# EAGLE design L298card2007 (EAGLE 4.16)
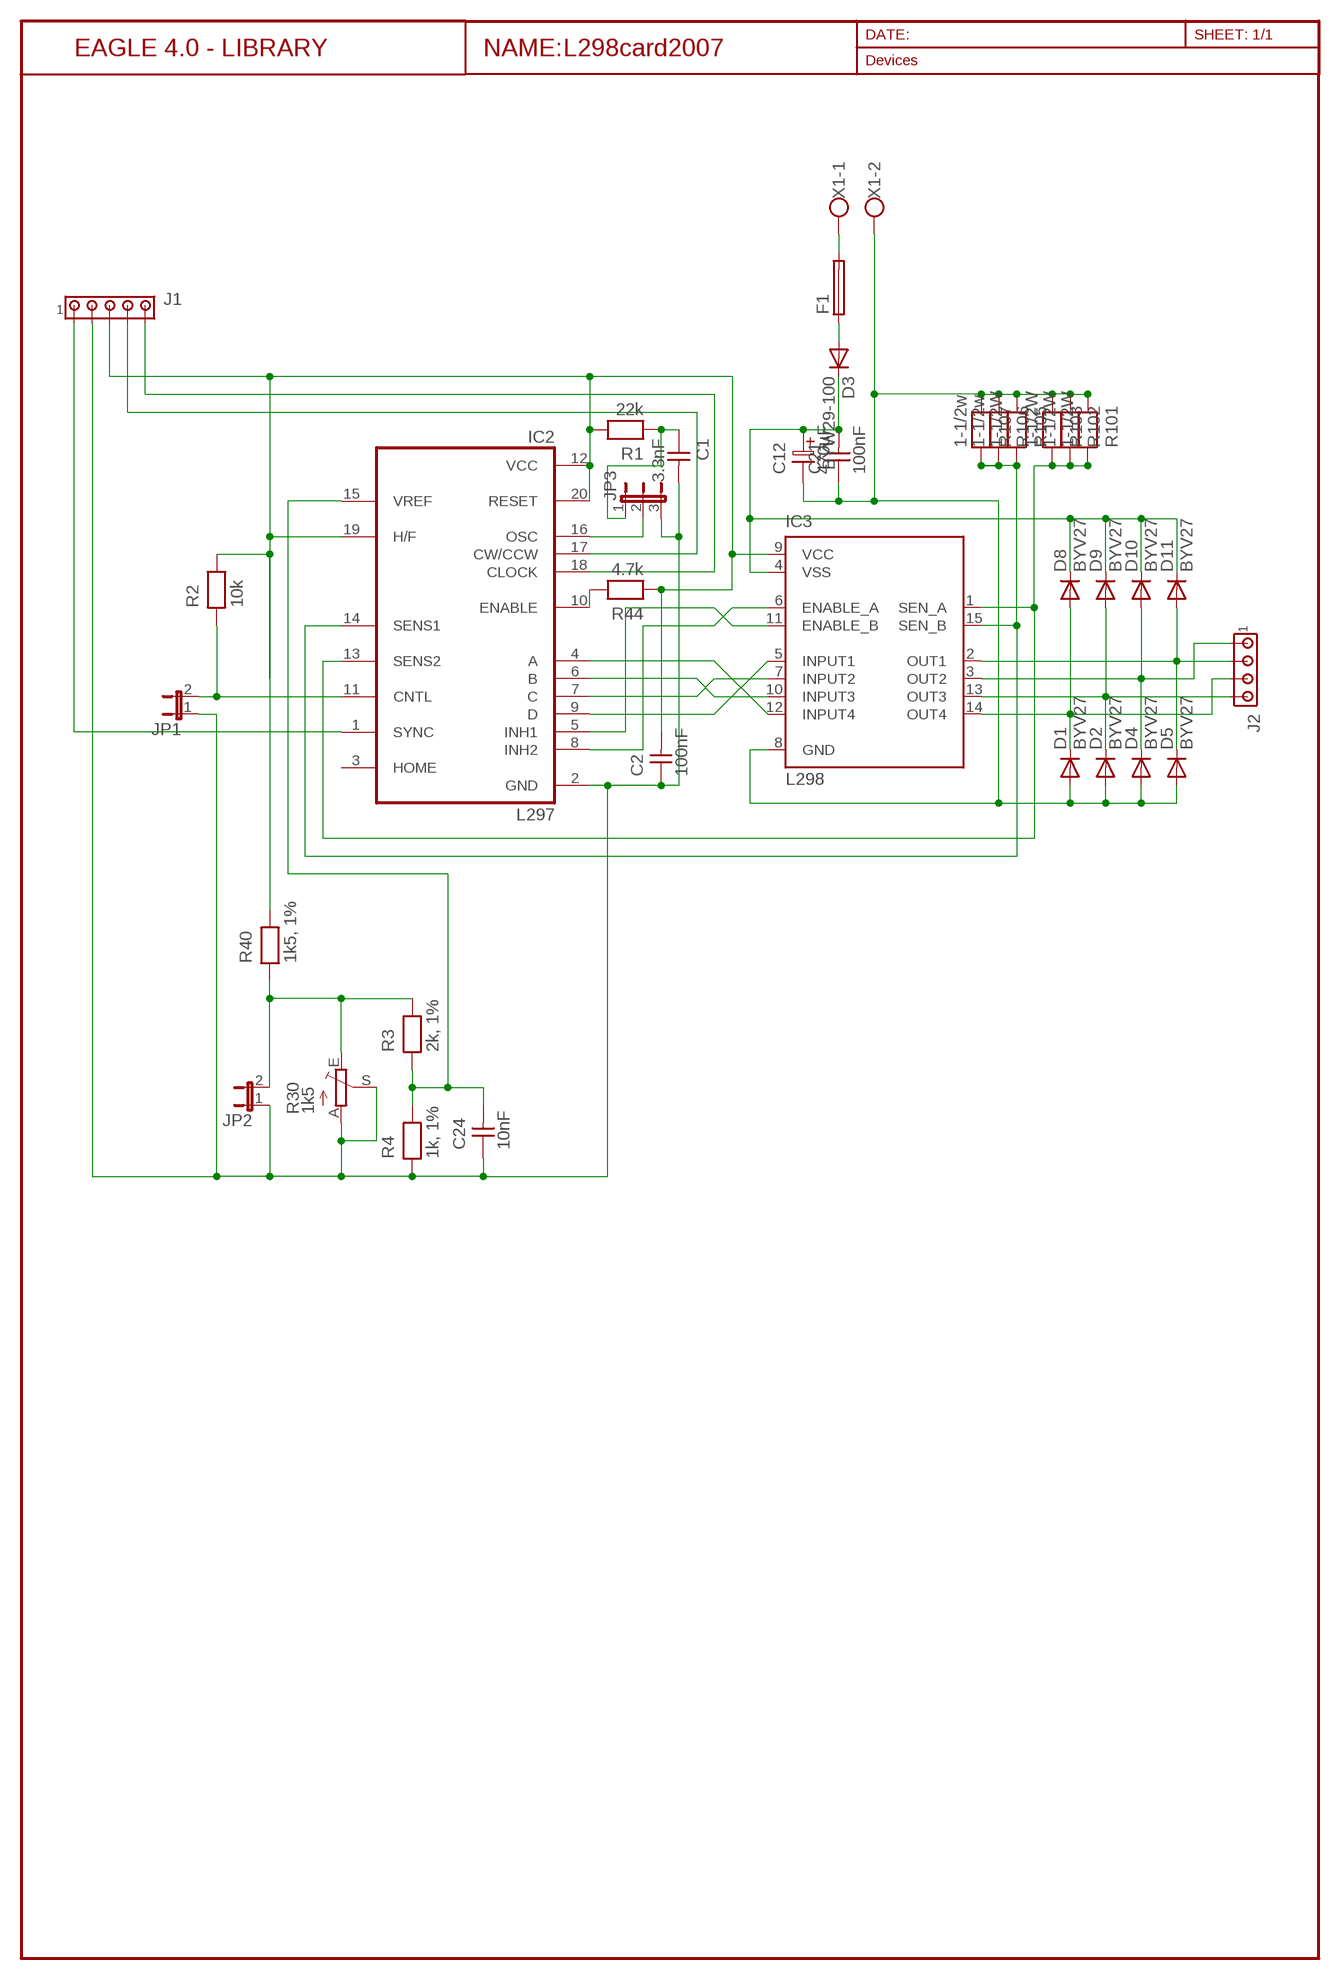
[diagram p0: schematic, sheet 1]

## Parts
C1  3.3nF  CAPNP-5  [C-5]
C2  100nF  CAPNP-5  [C-5]
C12  470µF  ELC-5L  [ES-5L]
C21  100nF  CAPNP-5  [C-5]
C24  10nF  CAPNP-5  [C-5]
D1  BYV27  [SOD57-10]
D2  BYV27  [SOD57-10]
D3  BYW29-100  BYW29  [DO220S]
D4  BYV27  [SOD57-10]
D5  BYV27  [SOD57-10]
D8  BYV27  [SOD57-10]
D9  BYV27  [SOD57-10]
D10  BYV27  [SOD57-10]
D11  BYV27  [SOD57-10]
F1  TE5  [TE5]
IC2  L297  [DIL20]
IC3  L298  [MULTIWATT-15]
J1  MTA05-100  [10X05MTA]
J2  MTA04-100  [10X04MTA]
JP1  JP1E  [JP1]
JP2  JP1E  [JP1]
JP3  JP2EROUND  [JP2R]
R1  22k  RESEU-7,5-10  [R-10]
R2  10k  RESEU-10  [R-10]
R3  2k, 1%  RESEU-10  [R-10]
R4  1k, 1%  RESEU-10  [R-10]
R30  1k5  TRIM_EU-S64W  [S64W]
R40  1k5, 1%  RESEU-7,5-10  [R-10]
R44  4.7k  RESEU-7,5-10  [R-10]
R101  1-1/2W  RESEU-10  [R-10]
R102  1-1/2W  RESEU-10  [R-10]
R103  1-1/2W  RESEU-10  [R-10]
R105  1-1/2W  RESEU-10  [R-10]
R106  1-1/2w  RESEU-10  [R-10]
R107  1-1/2w  RESEU-10  [R-10]
X1  AK500/2  [AK500/2]

## Nets
A: D1.C D8.A IC3.14(OUT4) J2.3
B: D2.C D9.A IC3.13(OUT3) J2.4
C: D4.C D10.A IC3.3(OUT2) J2.1
CLK: IC2.18(CLOCK) J1.5
CTRL [MEDIUM]: IC2.11(CNTL) JP1.2 R2.1
CW: IC2.17(CW/CCW) J1.4
D: D5.C D11.A IC3.2(OUT1) J2.2
GND: C1.2 C2.1 C12.2 C21.1 C24.1 D1.A D2.A D4.A D5.A IC2.2(GND) IC3.8(GND) J1.2 JP1.1 JP2.1 JP3.3 R4.1 R30.A R30.S R101.2 R102.2 R103.2 R105.2 R106.2 R107.2 X1.2
INH_1: IC2.5(INH1) IC3.11(ENABLE_B)
INH_2: IC2.8(INH2) IC3.6(ENABLE_A)
N$1: D3.A F1.1
N$2: F1.2 X1.1
N$11: IC2.10(ENABLE) R44.2
N$12: IC2.16(OSC) JP3.2
N$15: C1.1 JP3.1 R1.1
SENSE_1: IC2.14(SENS1) IC3.15(SEN_B) R105.1 R106.1 R107.1
SENSE_2: IC2.13(SENS2) IC3.1(SEN_A) R101.1 R102.1 R103.1
SIG_A: IC2.4(A) IC3.12(INPUT4)
SIG_B: IC2.6(B) IC3.10(INPUT3)
SIG_C: IC2.7(C) IC3.7(INPUT2)
SIG_D: IC2.9(D) IC3.5(INPUT1)
SYNC: IC2.1(SYNC) J1.1
VCC [MEDIUM]: C2.2 IC2.12(VCC) IC2.19(H/F) IC2.20(RESET) IC3.9(VCC) J1.3 R1.2 R2.2 R40.2 R44.1
VMES: JP2.2 R3.2 R30.E R40.1
VREF: C24.2 IC2.15(VREF) R3.1 R4.2
VS: C12.1 C21.2 D3.C D8.C D9.C D10.C D11.C IC3.4(VSS)
Unconnected: IC2.3(HOME)

## Library data of the parts
C1 C2 C21 C24 = discrete:CAPNP-5
C12 = discrete:ELC-5L
D1 D2 D4 D5 D8-D11 = diode:BYV27: DIODE ultra fast
D3 = diode:BYW29: DIODE ultra fast rectifier, 200 V, 8 A
F1 = fuse:TE5: FUSE Wickmann
IC2 = st-microelectronics:L297: STEPPER MOTOR CONTROLLER
IC3 = st-microelectronics:L298: DUAL FULL-BRIDGE DRIVER
J1 = con-amp:MTA05-100: AMP connector
J2 = con-amp:MTA04-100: AMP connector
JP1 JP2 = jumper:JP1E: JUMPER
JP3 = jumper:JP2E: JUMPER
R1 R40 R44 = discrete:RESEU-7,5
R2-R4 R101-R103 R105-R107 = discrete:RESEU-10
R30 = pot:TRIM_EU-: POTENTIOMETER
X1 = con-ptr500:AK500/2: CONNECTOR

## Net classes
0 default: width 0.508 mm, drill 0.381 mm, clearance 0.508 mm
1 POWER: width 1.676 mm, drill 0.508 mm, clearance 0.762 mm
2 MEDIUM: width 0.813 mm, drill 0.381 mm, clearance 0.635 mm
3 MAXPOWER: width 2.54 mm
4 Text: width 0.102 mm

## Board
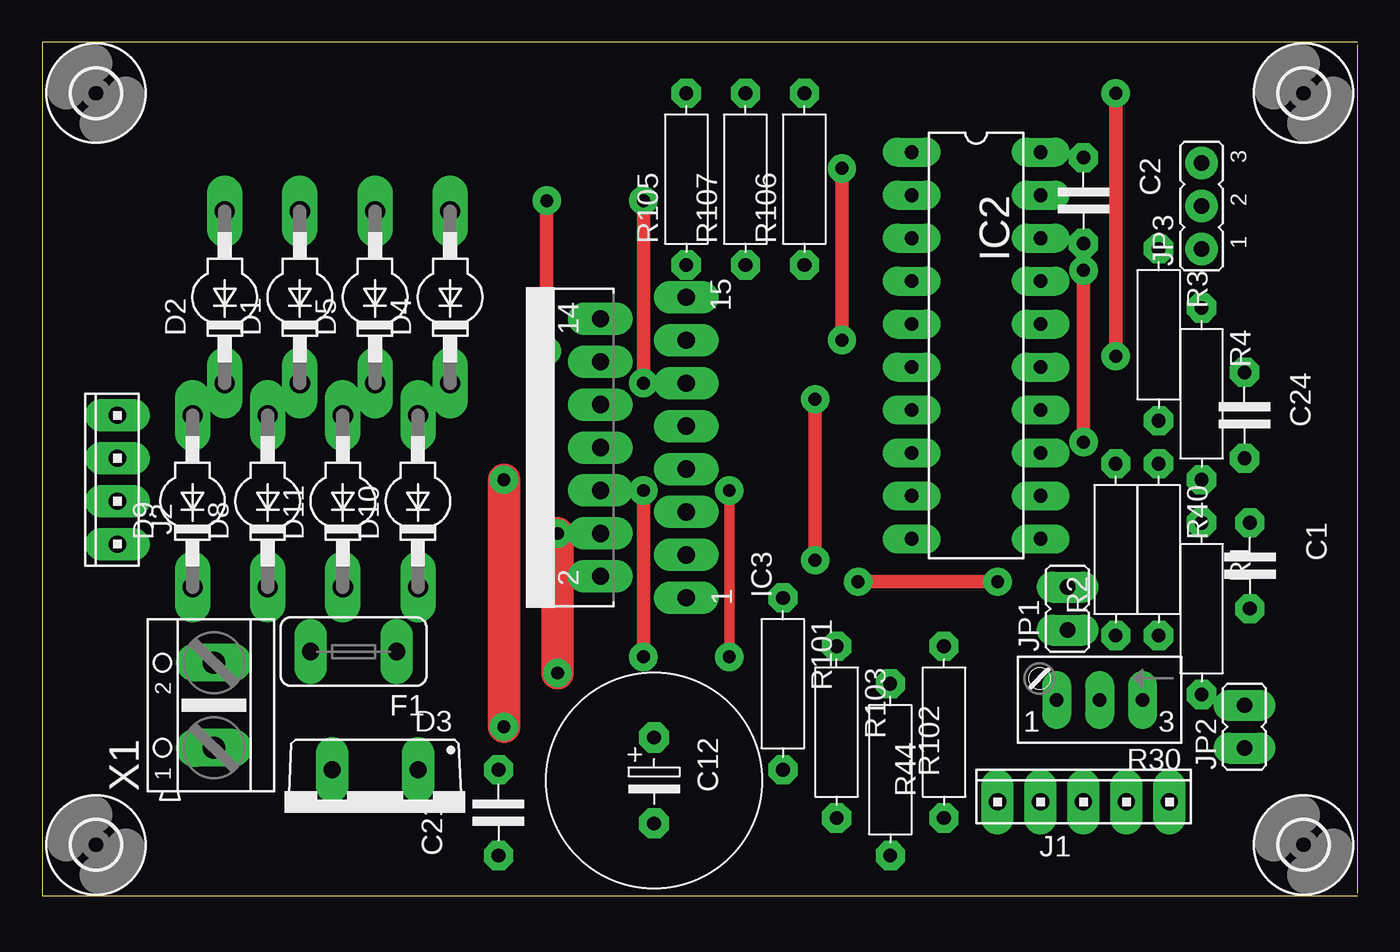
[diagram p1: board, top side]
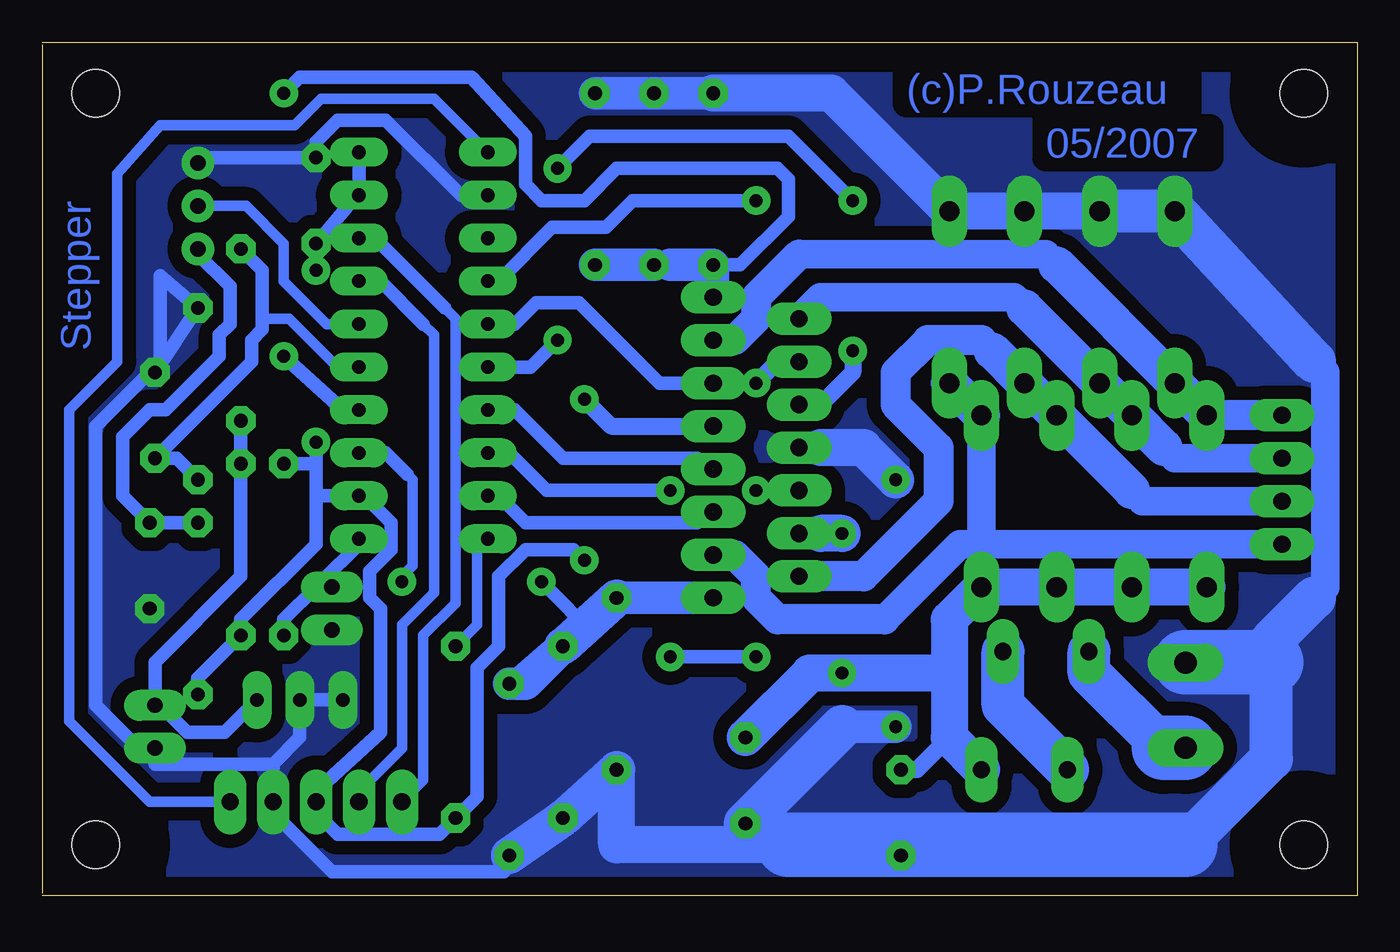
[diagram p2: board, bottom side, seen from below]

Size 77.78 x 50.47 mm. Coordinates in mm from the lower left corner, seen from the top.
Outline: 77.78,0 0,0 0,50.47 77.78,50.47
Outline: 77.78,50.32 77.78,0.15
Copper layers (1*16): Top 0.035mm / dielectric 1.5mm / Bottom 0.035mm
Design rules "default": minimum track width 24mil, minimum drill 30mil, track to track 20mil, track to pad 16mil, pad to pad 16mil, via to via 18mil, smd to smd 15mil, copper to edge 40mil, drill to drill 18mil, minimum pad ring 18mil, minimum via ring 18mil, stop-mask expansion 5mil, vias tented up to drill 0mil, thermal gap 10mil

### Footprints (pad centres in the part's own frame; a part is rotated, then mirrored left to right if it is on the bottom)
C-5 = drill 0.813 pad 1.6 octagon: 1 -2.54,0; 2 2.54,0
ES-5L = drill 0.813 pad 1.778 octagon: 1 0,0; 2 5.08,0
SOD57-10 = drill 1.194 long: A 5.08,0; C -5.08,0
DO220S = drill 1.016 long: A 2.54,-2.54; C -2.54,-2.54
TE5 = drill 1.016 long: 1 -2.54,0; 2 2.54,0
DIL20 = drill 0.813 long: 1 -11.43,-3.81; 2 -8.89,-3.81; 3 -6.35,-3.81; 4 -3.81,-3.81; 5 -1.27,-3.81; 6 1.27,-3.81; 7 3.81,-3.81; 8 6.35,-3.81; 9 8.89,-3.81; 10 11.43,-3.81; 11 11.43,3.81; 12 8.89,3.81; 13 6.35,3.81; 14 3.81,3.81; 15 1.27,3.81; 16 -1.27,3.81; 17 -3.81,3.81; 18 -6.35,3.81; 19 -8.89,3.81; 20 -11.43,3.81
MULTIWATT-15 = drill 1.016 long: 1 -8.89,-7.62; 2 -7.62,-2.54; 3 -6.35,-7.62; 4 -5.08,-2.54; 5 -3.81,-7.62; 6 -2.54,-2.54; 7 -1.27,-7.62; 8 0,-2.54; 9 1.27,-7.62; 10 2.54,-2.54; 11 3.81,-7.62; 12 5.08,-2.54; 13 6.35,-7.62; 14 7.62,-2.54; 15 8.89,-7.62
10X05MTA = drill 1.016 long: 1 5.08,0; 2 2.54,0; 3 0,0; 4 -2.54,0; 5 -5.08,0
10X04MTA = drill 1.016 long: 1 -3.81,0; 2 -1.27,0; 3 1.27,0; 4 3.81,0
JP1 = drill 0.914 long: 1 0,-1.27; 2 0,1.27
JP2R = drill 0.914 pad 1.93 round: 1 -2.54,0; 2 0,0; 3 2.54,0
R-10 = drill 0.813 pad 1.6 octagon: 1 -5.08,0; 2 5.08,0
S64W = drill 0.813 long: A 2.54,1.27; E -2.54,1.27; S 0,1.27
2,8 = hole 2.8: 0,0
AK500/2 = drill 1.321 long: 1 -2.515,0; 2 2.515,0

### Placement (x,y rotation side)
C1  71.43,19.52 270 top
C2  61.59,41.11 270 top
C12  36.19,9.36 270 top
C21  26.98,4.92 90 top
C24  71.12,28.41 270 top
D1  15.23,35.4 90 top
D2  10.79,35.4 90 top
D3  19.68,4.92 180 top
D4  24.12,35.4 90 top
D5  19.68,35.4 90 top
D8  13.33,23.33 90 top
D9  8.88,23.33 90 top
D10  22.22,23.33 90 top
D11  17.78,23.33 90 top
F1  18.41,14.44 180 top
IC2  55.24,32.54 270 top
IC3  30.48,26.51 90 top
J1  61.59,5.55 0 top
J2  4.44,24.6 90 top
JP1  60.64,16.98 0 top
JP2  71.12,10 0 top
JP3  68.58,40.79 90 top
R1  68.58,16.98 270 top
R2  63.49,20.47 90 top
R3  66.04,33.17 270 top
R4  68.58,29.68 270 top
R30  62.54,12.85 180 top
R40  66.04,20.47 270 top
R44  53.34,9.68 90 top
R101  43.81,12.54 270 top
R102  50.16,7.46 270 top
R103  46.98,9.68 270 top
R105  38.09,42.38 90 top
R106  45.08,42.38 90 top
R107  41.59,42.38 90 top
U$1  [2,8]  74.61,47.46 270 top
U$2  [2,8]  3.17,3.01 270 top
U$3  [2,8]  74.61,3.01 270 top
U$4  [2,8]  3.17,47.46 270 top
X1  10.15,11.27 90 top

### Tracks (layer width: path | path; a pad name or v marks a point on that pad's centre or on a via)
A
  Bottom 1.676: J2.3 10.79,25.87 11.42,26.51 | 19.68,34.76 20.32,35.4 31.75,35.4 IC3.14
  Bottom 2.184: 11.42,26.51 D8.A D1.C 19.68,34.76
B
  Bottom 1.676: 33.02,37.94 18.41,37.94 17.78,37.3
  Bottom 1.778: IC3.13 36.82,32.86 35.55,34.12 35.55,35.4 33.02,37.94 | J2.4 D9.A
  Bottom 2.184: D2.C D9.A D2.C | D2.C 17.78,37.3
C
  Bottom 1.676: J2.1 22.22,20.79 | 22.22,20.79 23.49,20.79 27.94,16.35 | 22.22,20.79 D10.A
  Bottom 1.778: IC3.3 36.82,20.16 35.55,18.89 35.55,17.62 34.28,16.35 27.94,16.35
  Bottom 2.184: D10.A D4.C
CLK
  Bottom 0.61: 53.97,34.76 53.34,34.12 53.34,17.3 55.24,15.39 55.24,6.82 J1.5
  Bottom 0.813: 53.97,34.76 58.1,38.89 IC2.18
CTRL
  Bottom 0.813: IC2.11 59.05,20.79 61.27,18.57 | 61.27,18.57 JP1.2 61.59,18.25 | 61.59,18.25 63.49,16.35 R2.1 | 61.27,18.57 61.59,18.25
CW
  Bottom 0.61: 55.24,33.81 54.6,33.17 54.6,17.93 56.51,16.03 56.51,8.73 59.05,6.18 J1.4
  Bottom 0.813: 55.24,33.81 57.78,36.35 IC2.17
D
  Bottom 1.676: 13.33,23.96 12.69,23.33 J2.2
  Bottom 1.778: IC3.2 29.21,18.89 24.76,23.33 24.76,26.51 27.3,29.05 27.3,30.95 25.39,32.86 22.22,32.86 21.59,32.22
  Bottom 2.184: 21.59,32.22 D5.C D11.A 13.33,23.96
GND  (via drill 0.76)
  Top 0.61: v27.3,24.6
  Top 1.93: v27.3,10 v27.3,24.6 | v27.3,10
  Bottom 0.61: 10.15,13.81 X1.2 | IC3.8 32.38,25.87 31.75,26.51 | 26.03,1.74 C21.1 26.03,3.01
  Bottom 0.813: R102.2 50.48,1.42 60.64,1.42 63.81,4.6 | 64.13,7.77 62.54,9.36 R30.S R30.A | 53.02,41.43 | 53.02,41.43 57.46,45.87 60.32,45.87 61.59,44.6 C2.1 68.58,43.65 JP3.3 | IC2.2 53.02,41.43 | J1.2 64.13,7.77 | 64.13,7.77 71.12,7.77 JP2.1 72.07,8.73 74.61,11.27 74.61,27.78 70.8,31.59 70.8,35.71 70.8,36.66 R4.1 C24.1
  Bottom 1.27: 10.18,14.42 10.18,14.47
  Bottom 1.676: 2.54,17.62 1.9,18.25 1.9,30.95 2.54,31.59
  Bottom 1.93: IC3.8 31.75,26.51 | 30.48,10 v27.3,10 | 40.63,47.46 42.54,47.46 R106.2 | 40.63,47.46 R107.2 | 40.63,47.46 R105.2 40.63,47.46
  Bottom 2.184: R102.2 R103.2 R101.2 43.81,3.01 33.65,3.01 | v27.3,24.6 | v27.3,24.6 29.21,26.51 31.75,26.51 | D1.A D5.A D4.A 31.11,47.46 R105.2
  Bottom 2.54: X1.2 10.18,14.42 | 2.54,17.62 5.08,15.08 5.08,13.81 5.08,8.09 10.15,3.01 | 2.54,31.59 D2.A D1.A | 30.48,10 C12.2 33.65,3.01
  Bottom 3.81: 5.08,13.81 10.15,13.81 | 10.15,3.01 26.03,3.01 33.65,3.01
  pour Bottom (isolate 0.813, no thermals): 1.58,1.42 78.1,1.42 78.1,48.41 1.58,48.41
INH_1
  Bottom 0.813: IC3.11 41.27,30.32 46.03,35.08 48.57,35.08 49.84,33.81 IC2.5
INH_2  (via drill 0.76)
  Top 0.61: v40.63,14.12 v40.63,23.96
  Top 0.813: v35.55,14.12 v35.55,23.96
  Bottom 0.813: v35.55,14.12 v40.63,14.12 | v40.63,14.12 | v40.63,23.96 47.94,23.96 50.16,26.19 IC2.8 | v35.55,23.96 | v35.55,23.96 IC3.6
N$1
  Bottom 2.54: F1.1 20.95,11.27 D3.A
N$2
  Bottom 2.54: 11.45,8.75 15.87,13.17 F1.2
  Bottom 3.81: X1.1 11.45,8.75
N$11
  Bottom 0.61: R44.2 52.06,16.03 52.06,20.47 IC2.10
N$12
  Bottom 0.61: IC2.16 60.95,33.81 63.49,36.35 63.49,38.57 65.72,40.79 JP3.2
N$15
  Bottom 0.813: R1.1 C1.1 73.02,23.65 73.02,27.14 71.43,28.73 70.48,28.73 67.31,31.9 67.31,33.17 66.67,33.81 66.67,36.03 68.58,37.94 JP3.1
SENSE_1  (via drill 0.76)
  Top 0.813: v63.49,47.46 63.49,32.86 v63.49,31.9
  Bottom 0.762: 40.63,37.3 R107.1 | R105.1
  Bottom 0.813: v63.49,31.9 60,28.73 IC2.14 | v63.49,47.46 62.54,48.41 52.38,48.41 49.21,44.92 49.21,42.06 48.25,41.11 45.71,41.11 43.81,43.02 34.28,43.02 33.65,42.38 33.65,40.16 36.51,37.3 R105.1 | v63.49,31.9 | v63.49,31.9
  Bottom 1.93: R107.1 R106.1 | R105.1 38.09,36.66 IC3.15 | R105.1 | R105.1 40.63,37.3
SENSE_2  (via drill 0.76)
  Top 0.813: v48.25,18.57 v56.51,18.57
  Bottom 0.61: 56.19,24.92 55.88,24.6 55.88,19.52 56.51,18.89 v56.51,18.57 | 45.4,16.03 45.71,16.35 45.87,16.19 | 49.52,12.54
  Bottom 0.813: 56.19,24.92 57.46,26.19 IC2.13 | 49.52,12.54 | R102.1 49.52,12.54 | 45.71,16.03 45.87,16.19 47.3,17.62 v48.25,18.57
  Bottom 1.93: R103.1 49.21,12.54 R102.1 49.52,12.54 R103.1 | R103.1 45.4,16.03 R101.1 IC3.1
  Bottom 2.184: R101.1 R103.1
SIG_A  (via drill 0.76)  (1 unrouted)
  Top 0.813: v35.55,30.32 v35.55,41.11
  Bottom 0.61: IC2.4
  Bottom 0.813: v35.55,41.11 42.86,41.11 44.45,39.52 47.62,39.52 50.79,36.35 IC2.4
  Bottom 1.016: v35.55,30.32 | IC3.12 34.28,31.59 v35.55,30.32
SIG_B  (via drill 0.76)
  Top 0.813: v47.3,43.02 v47.3,32.86 | v29.84,32.22 v29.84,41.11
  Bottom 0.813: v47.3,32.86 48.89,31.27 IC2.6 | v29.84,41.11 33.65,44.92 45.4,44.92 v47.3,43.02 | v47.3,43.02
  Bottom 1.016: v29.84,32.22 29.84,31.59 29.84,30.95 31.75,29.05 IC3.10 | v29.84,32.22
SIG_C  (1 unrouted)
  Bottom 0.61: IC2.7
  Bottom 0.813: IC2.7 49.84,28.73 46.98,25.87 39.05,25.87 38.41,25.23 IC3.7
SIG_D  (1 unrouted)
  Bottom 0.813: IC3.5 38.41,22.7 39.05,22.06 49.21,22.06 50.79,23.65 IC2.9
SYNC
  Bottom 0.61: IC2.1 54.6,47.14 61.27,47.14 62.86,45.55 70.8,45.55 73.34,42.7 73.34,31.59 76.2,28.73 76.2,10.31 71.43,5.55 J1.1
VCC  (via drill 0.76)
  Top 0.813: v61.59,26.82 v61.59,36.98 | v45.71,19.84 45.71,29.05 v45.71,29.36
  Bottom 0.813: IC2.19 IC2.20 | IC2.20 59.05,43.02 | v61.59,36.98 C2.2 59.68,40.79 IC2.19 | IC2.19 IC2.20 | IC2.19 IC2.20 | IC2.19 IC2.20 | 61.59,23.65 61.59,20.79 66.04,16.35 R40.2 68.58,12.85 R1.2 | 61.59,23.65 IC2.12 58.73,23.65 57.14,22.06 57.14,20.47 58.41,19.2 58.41,17.62 57.78,16.98 57.78,9.68 61.59,6.18 J1.3 61.59,4.92 60.32,3.65 54.29,3.65 R44.1 52.06,5.87 52.06,13.49 50.79,14.76 50.79,18.89 49.21,20.47 46.35,20.47 v45.71,19.84 | 61.59,23.65 61.59,25.55 | 61.59,25.55 v61.59,26.82 | 61.59,25.55 R2.2 | v45.71,19.84 | 59.05,43.02 59.05,41.11 | IC2.20 59.05,43.02
  Bottom 1.016: v45.71,29.36 45.4,29.05 44.13,27.78 IC3.9
VMES
  Bottom 0.813: R30.E 66.99,9.68 69.21,9.68 70.48,10.95 70.8,11.27 JP2.2 71.12,13.81 66.04,18.89 R40.1 66.04,27.46 | 66.04,27.46 66.04,26.51 | 66.04,27.46 R3.2
VREF
  Bottom 0.61: IC2.15 60.32,31.27 63.18,34.12 64.77,34.12
  Bottom 0.813: R3.1 64.77,36.98 64.77,34.12 64.77,33.49 65.4,32.86 65.4,31.59 C24.2 69.84,25.87 R4.2
VS  (via drill 0.76)
  Top 0.61: v30.48,21.43 30.48,20.79
  Top 0.762: v30.48,21.43
  Top 1.93: v30.48,13.17 v30.48,21.43 | v30.48,21.43
  Bottom 1.016: 24.12,9.36 26.03,7.46 C21.2
  Bottom 1.93: 31.75,21.43 IC3.4 | D10.C
  Bottom 2.184: D11.C D10.C | D10.C 24.12,16.35 | 24.12,13.17 24.12,9.36 D3.C | D11.C D8.C D9.C | D10.C 24.12,16.35 | 24.12,16.35 24.12,13.17 | 24.12,13.17 v30.48,13.17 32.38,13.17 C12.1 | v30.48,21.43 31.75,21.43 | D11.C D10.C | D10.C

### Text on the board
Bottom: (c)P.Rouzeau | 05/2007 | Stepper